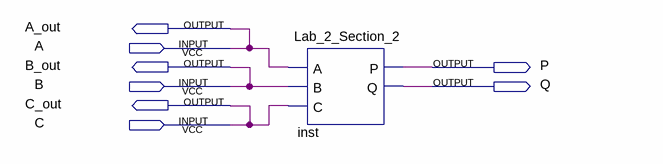
[diagram p0: schematic sheet]
// Quartus schematic Section_2.bdf as structural Verilog: 1 symbols, 8 pins
module Section_2 (
  input  A,
  input  B,
  input  C,
  output A_out,
  output B_out,
  output P,
  output Q,
  output C_out
);

  Lab_2_Section_2 inst (.A(A), .B(B), .C(C), .P(P), .Q(Q));

  assign A_out = A;
  assign B_out = B;
  assign C_out = C;
endmodule
